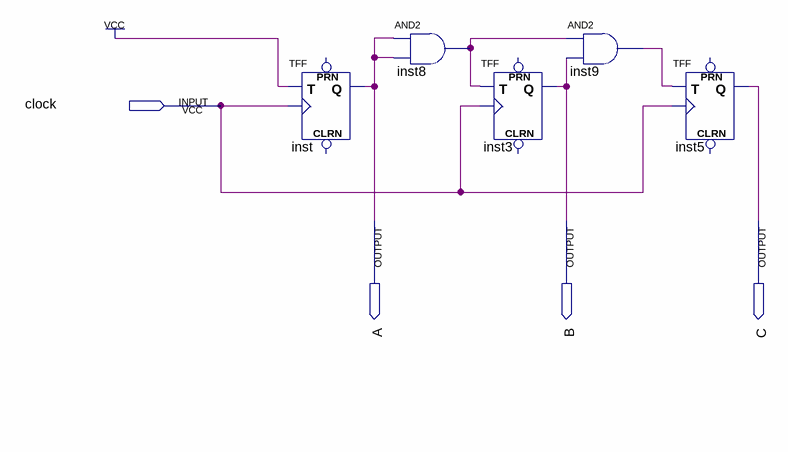
[diagram p0: schematic sheet]
// Quartus schematic Contador.bdf as structural Verilog: 5 symbols, 4 pins
module Contador (
  input  clock,
  output A,
  output B,
  output C
);

  wire inst8_out, inst9_out;

  TFF inst (.T(1'b1), .CLK(clock), .Q(A));  // open: PRN, CLRN
  and inst8 (inst8_out, A, A);
  TFF inst3 (.T(inst8_out), .CLK(clock), .Q(B));  // open: PRN, CLRN
  and inst9 (inst9_out, inst8_out, B);
  TFF inst5 (.T(inst9_out), .CLK(clock), .Q(C));  // open: PRN, CLRN
endmodule
